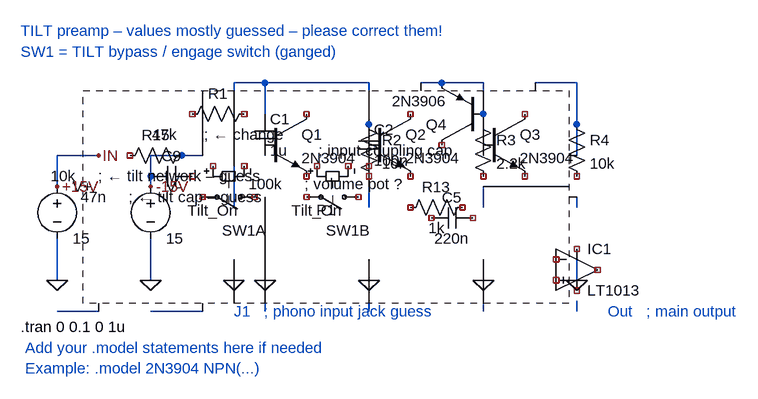
[diagram p0: schematic tilt-preamp.asc]
tilt-preamp.asc, the LTspice schematic file:
Version 4
SHEET 1 1280 920
WIRE -48 48 -96 48
WIRE 112 48 -48 48
WIRE 288 48 192 48
WIRE 432 48 368 48
WIRE -96 96 -96 48
WIRE -48 96 -48 48
WIRE 112 112 112 48
WIRE 288 112 288 48
WIRE -304 160 -368 160
WIRE -144 160 -224 160
WIRE -48 160 -48 144
WIRE 112 160 112 144
WIRE 288 160 288 144
WIRE 432 160 432 48
WIRE -368 208 -368 160
WIRE -224 208 -224 160
WIRE -96 240 -96 176
WIRE -48 240 -48 224
WIRE 112 240 112 208
WIRE 288 240 288 208
WIRE 432 240 432 224
WIRE -368 352 -368 288
WIRE -224 352 -224 288
WIRE -96 352 -96 320
WIRE -48 352 -48 320
WIRE 112 352 112 320
WIRE 288 352 288 320
WIRE 432 352 432 320
WIRE -304 400 -368 400
WIRE -144 400 -224 400
WIRE -48 400 -48 384
WIRE 112 400 112 384
WIRE 288 400 288 384
WIRE 432 400 432 384
FLAG -368 352 0
FLAG -224 352 0
FLAG -96 352 0
FLAG -48 352 0
FLAG 112 352 0
FLAG 288 352 0
FLAG 432 352 0
FLAG -368 208 +15V
FLAG -224 208 -15V
FLAG -304 160 IN
SYMBOL voltage -368 192 R0
WINDOW 123 0 0 Left 2
WINDOW 39 0 0 Left 2
SYMATTR InstName V+
SYMATTR Value 15
SYMBOL voltage -224 192 R0
WINDOW 123 0 0 Left 2
WINDOW 39 0 0 Left 2
SYMATTR InstName V-
SYMATTR Value 15
SYMBOL res -64 80 R90
WINDOW 0 0 56 VBottom 2
WINDOW 3 32 56 VTop 2
SYMATTR InstName R1
SYMATTR Value 47k      ; ← change
SYMBOL cap -64 96 R0
SYMATTR InstName C1
SYMATTR Value 1u       ; input coupling cap
SYMBOL pot -48 128 R180
WINDOW 39 24 96 Left 2
SYMATTR InstName P1
SYMATTR Value 100k     ; volume pot ?
SYMBOL res 96 96 R0
SYMATTR InstName R2
SYMATTR Value 10k
SYMBOL cap 96 112 R0
SYMATTR InstName C2
SYMATTR Value 100n
SYMBOL res 272 96 R0
SYMATTR InstName R3
SYMATTR Value 2.2k
SYMBOL res 416 96 R0
SYMATTR InstName R4
SYMATTR Value 10k
SYMBOL npn -48 96 R0
SYMATTR InstName Q1
SYMATTR Value 2N3904
SYMBOL npn 112 96 R0
SYMATTR InstName Q2
SYMATTR Value 2N3904
SYMBOL pnp 288 144 R180
SYMATTR InstName Q4
SYMATTR Value 2N3906
SYMBOL npn 288 96 R0
SYMATTR InstName Q3
SYMATTR Value 2N3904
SYMBOL opamps/LT1013 432 272 R0
SYMATTR InstName IC1
SYMBOL res -160 144 R90
WINDOW 0 0 56 VBottom 2
WINDOW 3 32 56 VTop 2
SYMATTR InstName R15
SYMATTR Value 10k     ; ← tilt network – guess
SYMBOL cap -160 176 R90
WINDOW 0 0 32 VBottom 2
WINDOW 3 32 32 VTop 2
SYMATTR InstName C9
SYMATTR Value 47n     ; ← tilt cap – guess
SYMBOL sw -48 224 R90
WINDOW 0 36 32 VTop 2
WINDOW 3 36 80 VBottom 2
SYMATTR InstName SW1A
SYMATTR Value Tilt_On
SYMBOL sw 112 224 R90
WINDOW 0 36 32 VTop 2
WINDOW 3 36 80 VBottom 2
SYMATTR InstName SW1B
SYMATTR Value Tilt_On
SYMBOL res 272 224 R90
WINDOW 0 0 56 VBottom 2
WINDOW 3 32 56 VTop 2
SYMATTR InstName R13
SYMATTR Value 1k
SYMBOL cap 272 240 R90
WINDOW 0 0 32 VBottom 2
WINDOW 3 32 32 VTop 2
SYMATTR InstName C5
SYMATTR Value 220n
TEXT -424 424 Left 2 !.tran 0 0.1 0 1u
TEXT -424 456 Left 2 ; Add your .model statements here if needed
TEXT -424 488 Left 2 ; Example: .model 2N3904 NPN(...)
TEXT -96 400 Left 2 J1   ; phono input jack guess
TEXT 480 400 Left 2 Out   ; main output
TEXT -424 -32 Left 2 TILT preamp – values mostly guessed – please correct them!
TEXT -424 0 Left 2 SW1 = TILT bypass / engage switch (ganged)

The netlist it stands for:
* tilt-preamp.asc
V+ IN 0 15
V- -15V 0 15
R1 NC_01 NC_02 47k      ; ← change
C1 N001 N004 1u       ; input coupling cap
* P1: 100k     ; volume pot ? (symbol pot not available, pin order unknown); nets seen at it: -15V, 0, N001, N002, N003, N005, N006, N007, N008, N009, N010, N011, N012, N013, N014, N015, N016
R2 N001 NC_03 10k
C2 N001 NC_04 100n
R3 N002 NC_05 2.2k
R4 N003 NC_06 10k
Q1 NC_07 N004 NC_08 0 2N3904
Q2 NC_09 N005 NC_10 0 2N3904
Q4 NC_11 N002 N002 0 2N3906
Q3 NC_12 N006 NC_13 0 2N3904
* IC1: LT1013 (symbol opamps/LT1013 not certain, pin order unknown); nets seen at it: 
R15 -15V NC_19 10k     ; ← tilt network – guess
C9 NC_20 -15V 47n     ; ← tilt cap – guess
SW1A NC_21 NC_22 NC_23 NC_24 Tilt_On
SW1B NC_25 NC_26 NC_27 NC_28 Tilt_On
R13 NC_29 NC_30 1k
C5 NC_31 NC_32 220n
.model NPN NPN
.model PNP PNP
.lib standard.bjt
.tran 0 0.1 0 1u
*  Add your .model statements here if needed
*  Example: .model 2N3904 NPN(...)
* J1   ; phono input jack guess
* Out   ; main output
* TILT preamp – values mostly guessed – please correct them!
* SW1 = TILT bypass / engage switch (ganged)
.lib LTC.lib
.backanno
.end